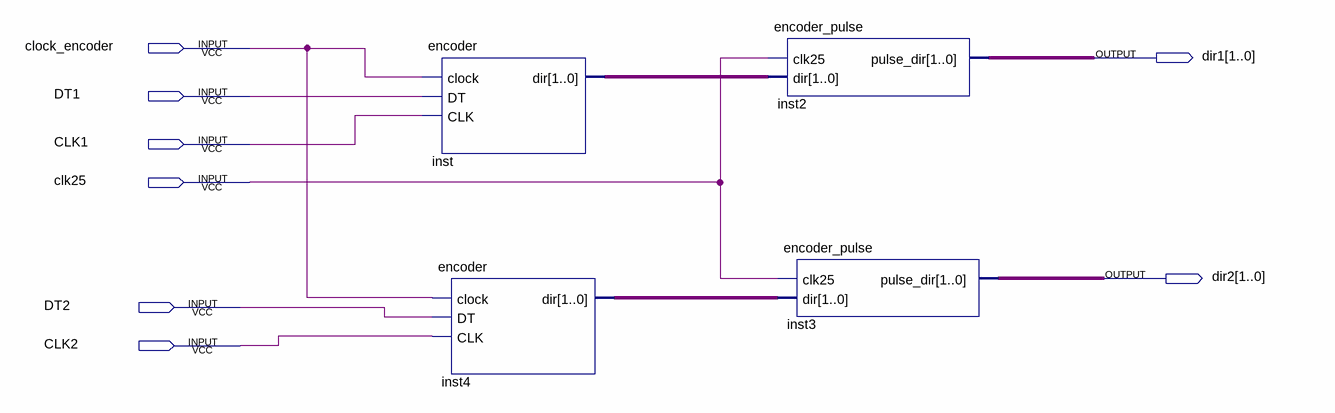
[diagram p0: schematic sheet]
// Quartus schematic Block_two-encoders.bdf as structural Verilog: 4 symbols, 8 pins
module \Block_two-encoders  (
  input  clock_encoder,
  input  DT1,
  input  CLK1,
  input  clk25,
  input  DT2,
  input  CLK2,
  output [1:0] dir1,
  output [1:0] dir2
);

  wire [1:0] inst4_dir, inst_dir;

  encoder inst (.clock(clock_encoder), .DT(DT1), .CLK(CLK1), .dir(inst_dir));
  encoder inst4 (.clock(clock_encoder), .DT(DT2), .CLK(CLK2), .dir(inst4_dir));
  encoder_pulse inst2 (.clk25(clk25), .dir(inst_dir), .pulse_dir(dir1));
  encoder_pulse inst3 (.clk25(clk25), .dir(inst4_dir), .pulse_dir(dir2));
endmodule
